# Altium schematic sheet pcuTC.SchDoc
size A3
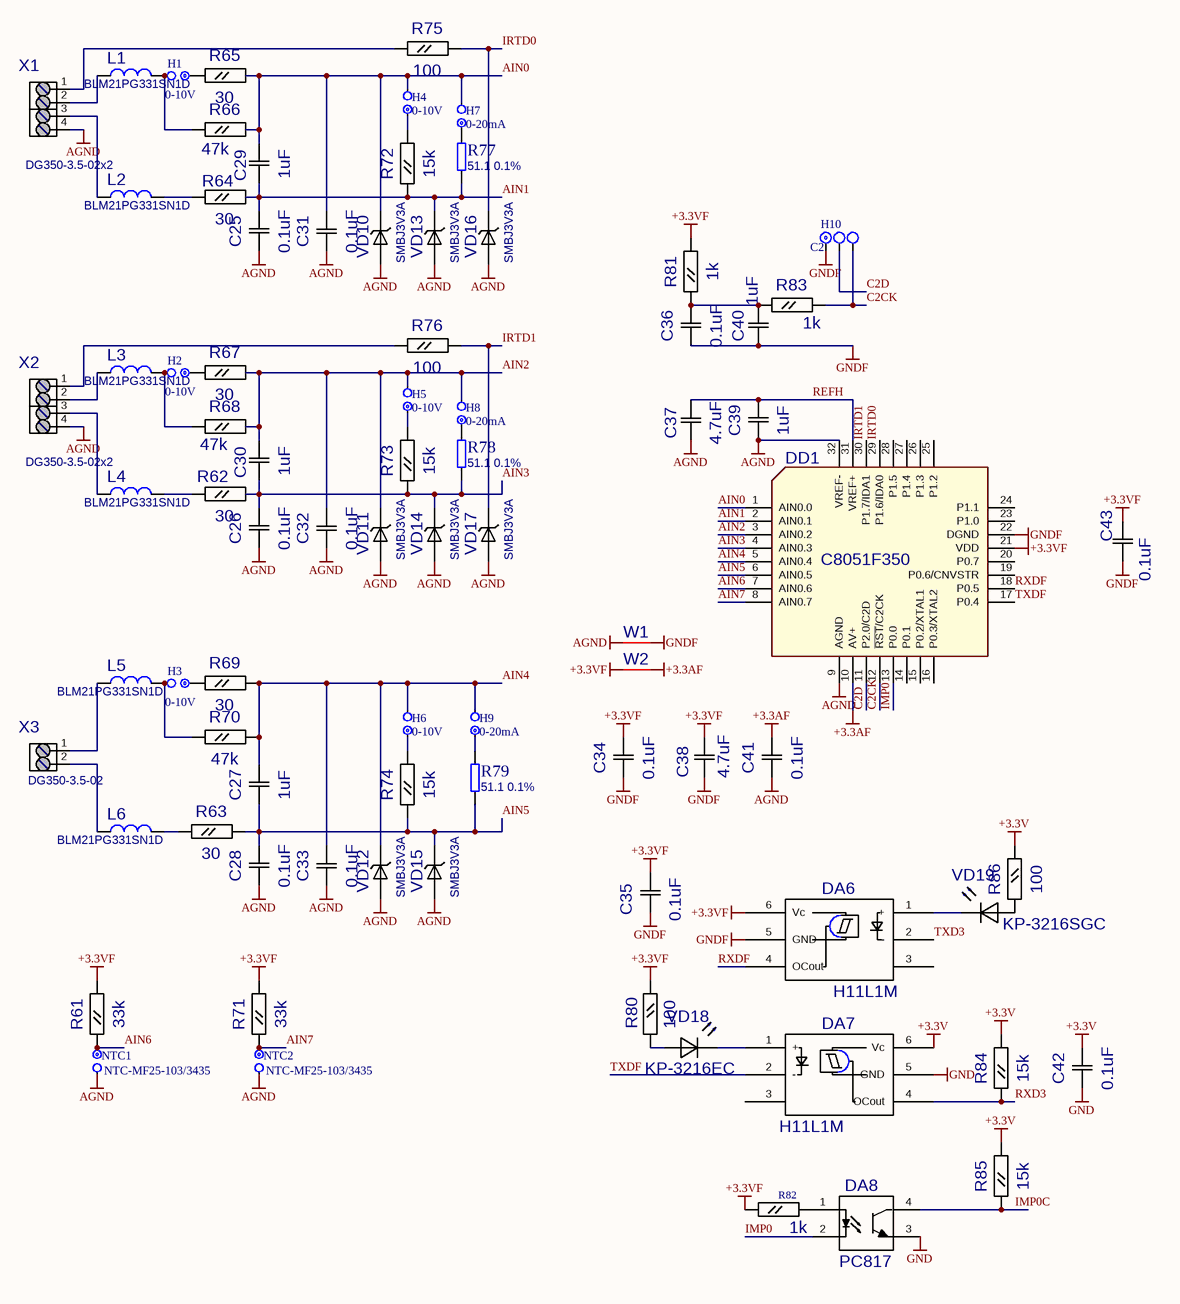
[diagram p0: pcuTC.SchDoc]

## Parts
C25  value 0.1uF  [C0805]  (hidden comment: C0805)
C26  value 0.1uF  [C0805]  (hidden comment: C0805)
C27  value 1uF  [C0805]  (hidden comment: C0805)
C28  value 0.1uF  [C0805]  (hidden comment: C0805)
C29  value 1uF  [C0805]  (hidden comment: C0805)
C30  value 1uF  [C0805]  (hidden comment: C0805)
C31  value 0.1uF  [C0805]  (hidden comment: C0805)
C32  value 0.1uF  [C0805]  (hidden comment: C0805)
C33  value 0.1uF  [C0805]  (hidden comment: C0805)
C34  value 0.1uF  [C0805]  (hidden comment: C0805)
C35  value 0.1uF  [C0805]  (hidden comment: C0805)
C36  value 0.1uF  [C0805]  (hidden comment: C0805)
C37  value 4.7uF  [C0805]  (hidden comment: C0805)
C38  value 4.7uF  [C0805]  (hidden comment: C0805)
C39  value 1uF  [C0805]  (hidden comment: C0805)
C40  value 1uF  [C0805]  (hidden comment: C0805)
C41  value 0.1uF  [C0805]  (hidden comment: C0805)
C42  value 0.1uF  [C0805]  (hidden comment: C0805)
C43  value 0.1uF  [C0805]  (hidden comment: C0805)
DA6  H11L1M  [DIP6_SURFACE]
DA7  H11L1M  [DIP6_SURFACE]
DA8  PC817  [DIL4SMD]
DD1  C8051F350  [LQFP-32_N]
H1  (no value)  [J1x2]
H2  (no value)  [J1x2]
H3  (no value)  [J1x2]
H4  (no value)  [J1x2]
H5  (no value)  [J1x2]
H6  (no value)  [J1x2]
H7  (no value)  [J1x2]
H8  (no value)  [J1x2]
H9  (no value)  [J1x2]
H10  C2  [J1x3]
L1  BLM21PG331SN1D  [R0805]
L2  BLM21PG331SN1D  [R0805]
L3  BLM21PG331SN1D  [R0805]
L4  BLM21PG331SN1D  [R0805]
L5  BLM21PG331SN1D  [R0805]
L6  BLM21PG331SN1D  [R0805]
NTC1  (no value)  [J1x2]
NTC2  (no value)  [J1x2]
R61  value 33k  [R0805]  (hidden comment: R0805)
R62  value 30  [R0805]  (hidden comment: R0805)
R63  value 30  [R0805]  (hidden comment: R0805)
R64  value 30  [R0805]  (hidden comment: R0805)
R65  value 30  [R0805]  (hidden comment: R0805)
R66  value 47k  [R0805]  (hidden comment: R0805)
R67  value 30  [R0805]  (hidden comment: R0805)
R68  value 47k  [R0805]  (hidden comment: R0805)
R69  value 30  [R0805]  (hidden comment: R0805)
R70  value 47k  [R0805]  (hidden comment: R0805)
R71  value 33k  [R0805]  (hidden comment: R0805)
R72  value 15k  [R0805]  (hidden comment: R0805)
R73  value 15k  [R0805]  (hidden comment: R0805)
R74  value 15k  [R0805]  (hidden comment: R0805)
R75  value 100  [R0805]  (hidden comment: R0805)
R76  value 100  [R0805]  (hidden comment: R0805)
R77  51.1 0.1%  [R0.25-300]
R78  51.1 0.1%  [R0.25-300]
R79  51.1 0.1%  [R0.25-300]
R80  value 100  [R0805]  (hidden comment: R0805)
R81  value 1k  [R0805]  (hidden comment: R0805)
R82  value 1k  [R0805]  (hidden comment: R0805)
R83  value 1k  [R0805]  (hidden comment: R0805)
R84  value 15k  [R0805]  (hidden comment: R0805)
R85  value 15k  [R0805]  (hidden comment: R0805)
R86  value 100  [R0805]  (hidden comment: R0805)
VD10  value SMBJ3V3A  [DO-214AA(SMB)]  (hidden comment: 10BQ100)
VD11  value SMBJ3V3A  [DO-214AA(SMB)]  (hidden comment: 10BQ100)
VD12  value SMBJ3V3A  [DO-214AA(SMB)]  (hidden comment: 10BQ100)
VD13  value SMBJ3V3A  [DO-214AA(SMB)]  (hidden comment: 10BQ100)
VD14  value SMBJ3V3A  [DO-214AA(SMB)]  (hidden comment: 10BQ100)
VD15  value SMBJ3V3A  [DO-214AA(SMB)]  (hidden comment: 10BQ100)
VD16  value SMBJ3V3A  [DO-214AA(SMB)]  (hidden comment: 10BQ100)
VD17  value SMBJ3V3A  [DO-214AA(SMB)]  (hidden comment: 10BQ100)
VD18  KP-3216EC  [KP-3216]
VD19  KP-3216SGC  [KP-3216]
W1  Net connector  [Net connector0.5mm]  (value not drawn)  (net tie, no BOM)
W2  Net connector  [Net connector0.5mm]  (value not drawn)  (net tie, no BOM)
X1  DG350-3.5-02x2  [DG350-3.5-04 SLIM - duplicate]
X2  DG350-3.5-02x2  [DG350-3.5-04 SLIM - duplicate]
X3  DG350-3.5-02  [DG350-3.5-02 SLIM]

## Nets
+3.3AF: C41.2 DD1.10(AV+) W2.1
+3.3V: C42.2 DA7.6(Vc) R84.1 R85.1 R86.2
+3.3VF: C34.2 C35.1 C38.2 C43.2 DA6.6(Vc) DD1.21(VDD) R61.1 R71.1 R80.2 R81.1 R82.2 W2.2
AGND: C25.1 C26.1 C28.1 C31.2 C32.2 C33.2 C37.2 C39.1 C41.1 DD1.9(AGND) DD1.32(VREF-) NTC1.2 NTC2.2 VD10.2 VD11.2 VD12.2 VD13.2 VD14.2 VD15.2 VD16.2 VD17.2 W1.2 X1.4 X2.4
GND: C42.1 DA7.5(GND) DA8.3(E)
GNDF: C34.1 C35.2 C36.1 C38.1 C40.1 C43.1 DA6.5(GND) DD1.22(DGND) H10.1 W1.1
AIN0: C29.2 C31.1 DD1.1(AIN0.0) H4.2 H7.2 R65.1 R66.1 VD10.1
AIN1: C25.2 C29.1 DD1.2(AIN0.1) R64.1 R72.2 R77.1 VD13.1
AIN2: C30.2 C32.1 DD1.3(AIN0.2) H5.2 H8.2 R67.1 R68.1 VD11.1
AIN3: C26.2 C30.1 DD1.4(AIN0.3) R62.1 R73.2 R78.1 VD14.1
AIN4: C27.2 C33.1 DD1.5(AIN0.4) H6.2 H9.2 R69.1 R70.1 VD12.1
AIN5: C27.1 C28.2 DD1.6(AIN0.5) R63.1 R74.2 R79.1 VD15.1
AIN6: DD1.7(AIN0.6) NTC1.1 R61.2
AIN7: DD1.8(AIN0.7) NTC2.1 R71.2
C2CK: DD1.12(~{RST}/C2CK) H10.3 R83.1
C2D: DD1.11(P2.0/C2D) H10.2
IMP0: DA8.2(-) DD1.13(P0.0)
IMP0C: DA8.4(C) R85.2
IRTD0: DD1.29(P1.6/IDA0) R75.1 VD16.1
IRTD1: DD1.30(P1.7/IDA1) R76.1 VD17.1
REFH: C37.1 C39.2 DD1.31(VREF+)
RXD3: DA7.4(OCout) R84.2
RXDF: DA6.4(OCout) DD1.18(P0.5)
TXD3: DA6.2(-)
TXDF: DA7.2(-) DD1.17(P0.4)
NetC36_2: C36.2 C40.2 R81.2 R83.2
NetDA6_1: DA6.1(+) VD19.2
NetDA7_1: DA7.1(+) VD18.2
NetDA8_1: DA8.1(+) R82.1
NetH1_1: H1.1 R65.2
NetH1_2: H1.2 L1.2 R66.2
NetH2_1: H2.1 R67.2
NetH2_2: H2.2 L3.2 R68.2
NetH3_1: H3.1 R69.2
NetH3_2: H3.2 L5.2 R70.2
NetH4_1: H4.1 R72.1
NetH5_1: H5.1 R73.1
NetH6_1: H6.1 R74.1
NetH7_1: H7.1 R77.2
NetH8_1: H8.1 R78.2
NetH9_1: H9.1 R79.2
NetL1_1: L1.1 X1.2
NetL2_1: L2.1 X1.3
NetL2_2: L2.2 R64.2
NetL3_1: L3.1 X2.2
NetL4_1: L4.1 X2.3
NetL4_2: L4.2 R62.2
NetL5_1: L5.1 X3.1
NetL6_1: L6.1 X3.2
NetL6_2: L6.2 R63.2
NetR75_2: R75.2 X1.1
NetR76_2: R76.2 X2.1
NetR80_1: R80.1 VD18.1
NetR86_1: R86.1 VD19.1

Not connected (* = marked no-connect by the designer): DA6 3; DA7 3; DD1 14(P0.1) 15(P0.2/XTAL1) 16(P0.3/XTAL2) 19(P0.6/CNVSTR) 20(P0.7) 23(P1.0) 24(P1.1) 25(P1.2) 26(P1.3) 27(P1.4) 28(P1.5)

## Notes on the sheet
- (in symbol H-1x2) 0-20mA; NTC-MF25-103/3435; 0-10V

## Library data of the parts
C25-C43 = C0805: RefDes2: {RefDes2}
DA6 DA7 = H11L1M: RefDes2: {RefDes2}
DA8 = PC817: optocuple; Value: PC817
DD1 = C8051F350: RefDes2: {RefDes2}; Value: {Value}
H1-H9 NTC1 NTC2 = H-1x2
H10 = H-1x3
L1-L6 = BLM21PG331SN1D: Ferrite beads; Value: BLM21PG331SN1D
R61-R76 R80-R86 = R0805: RefDes2: {RefDes2}
R77-R79 = R-0.25W: 0.25W 5% 250V; Price: 0.01; Value: 51.1 0.1%
VD10-VD17 = 10BQ100: RefDes2: {RefDes2}
VD18 = KP-3216EC: RefDes2: {RefDes2}
VD19 = KP-3216SGC: RefDes2: {RefDes2}
X1 X2 = DG350-3.5-04: RefDes2: {RefDes2}
X3 = DG350-3.5-02: RefDes2: {RefDes2}